# EAGLE design multiwii-conn (EAGLE 6.4)
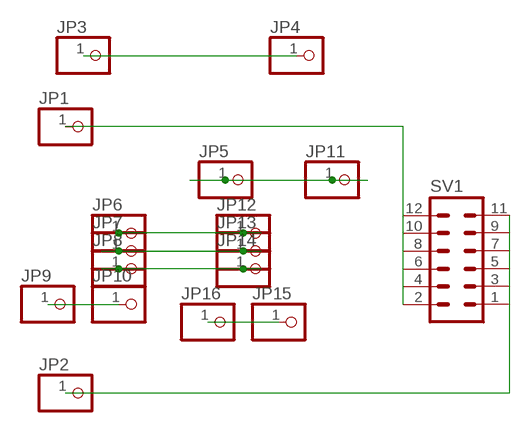
[diagram p0: schematic, sheet 1]

## Parts
JP1  PINHD-1X1  [1X01]
JP2  PINHD-1X1  [1X01]
JP3  PINHD-1X1  [1X01]
JP4  PINHD-1X1  [1X01]
JP5  PINHD-1X1  [1X01]
JP6  PINHD-1X1  [1X01]
JP7  PINHD-1X1  [1X01]
JP8  PINHD-1X1  [1X01]
JP9  PINHD-1X1  [1X01]
JP10  PINHD-1X1  [1X01]
JP11  PINHD-1X1  [1X01]
JP12  PINHD-1X1  [1X01]
JP13  PINHD-1X1  [1X01]
JP14  PINHD-1X1  [1X01]
JP15  PINHD-1X1  [1X01]
JP16  PINHD-1X1  [1X01]
SV1  MA06-2  [MA06-2]

## Nets
N$1: JP5.1 JP11.1
N$2: JP6.1 JP12.1
N$3: JP7.1 JP13.1
N$4: JP8.1 JP14.1
N$5: JP15.1 JP16.1
N$7: JP9.1 JP10.1
N$8: JP3.1 JP4.1
N$11: JP1.1 SV1.2 SV1.4 SV1.6 SV1.8 SV1.10 SV1.12
N$12: JP2.1 SV1.1 SV1.3 SV1.5 SV1.7 SV1.9 SV1.11

## Library data of the parts
JP1-JP16 = pinhead:PINHD-1X1: PIN HEADER
SV1 = con-lstb:MA06-2: PIN HEADER; OC_FARNELL: unknown; OC_NEWARK: unknown

## Board
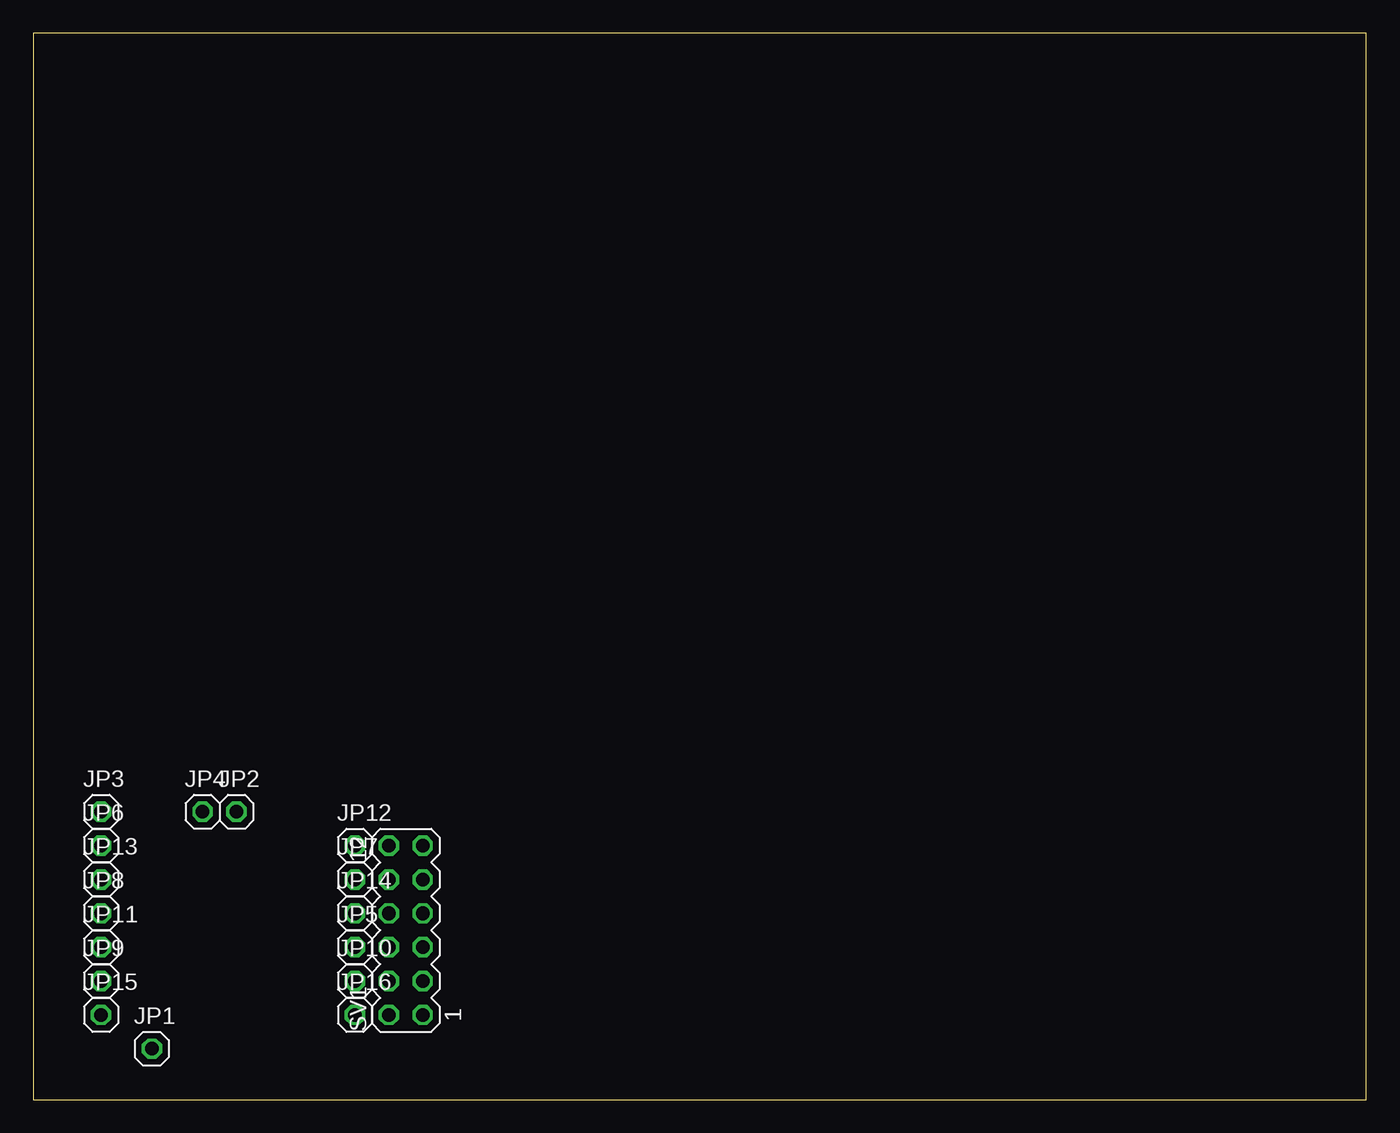
[diagram p1: board, top side]
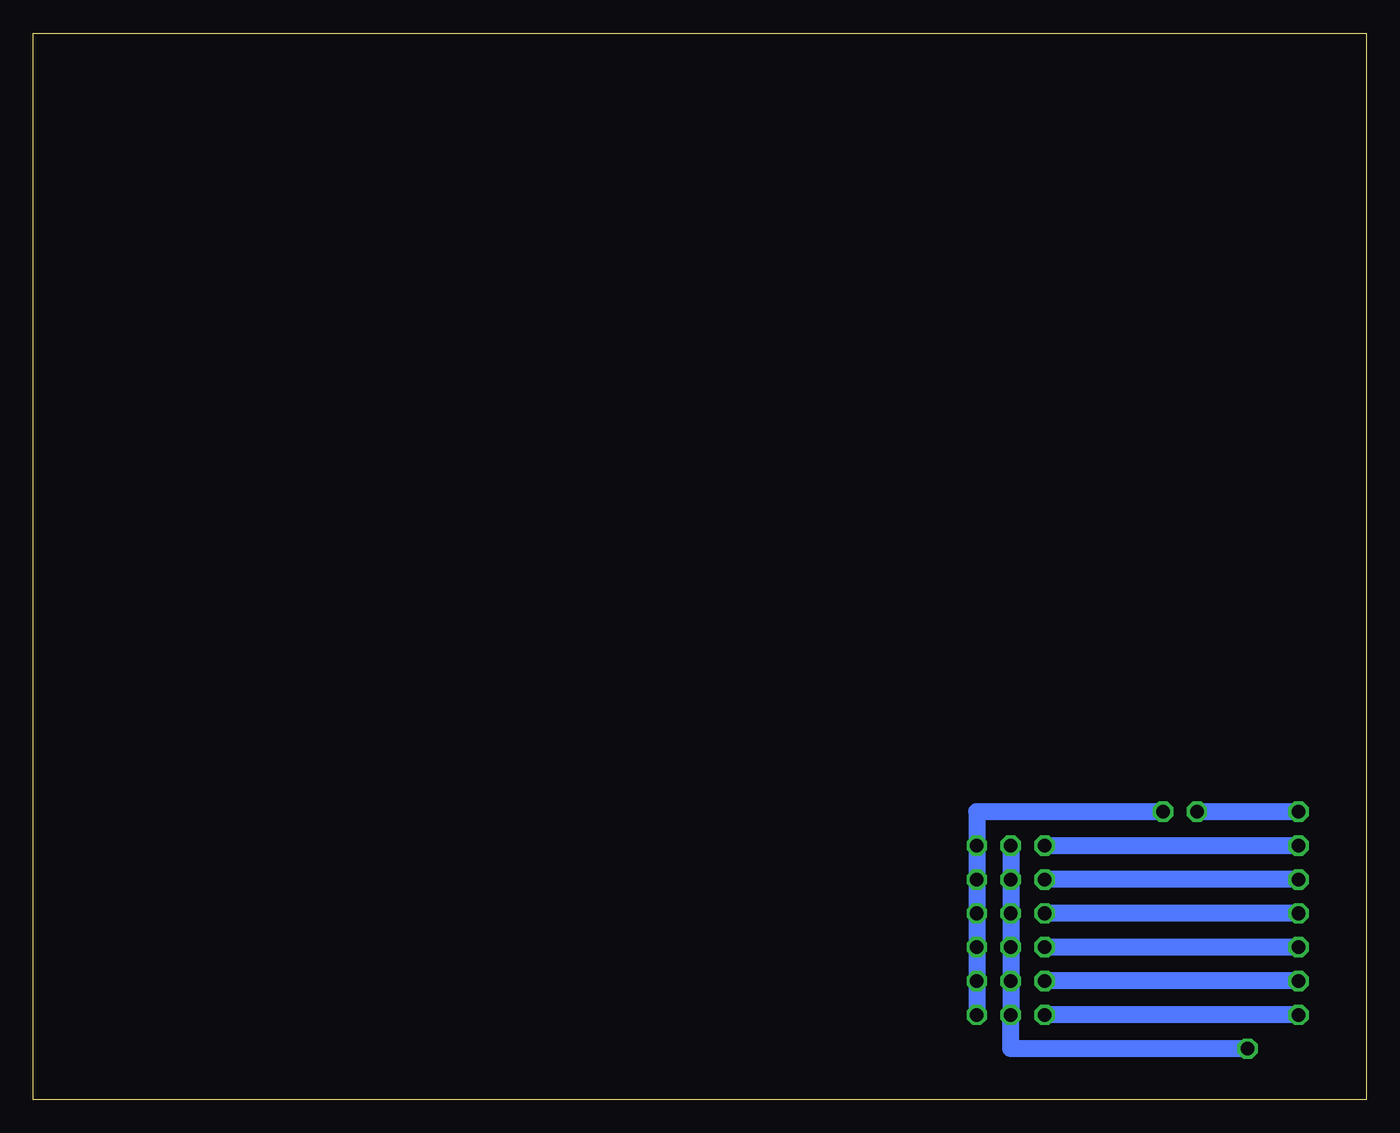
[diagram p2: board, bottom side, seen from below]

Size 100 x 80 mm. Coordinates in mm from the lower left corner, seen from the top.
Outline: 0,0 100,0 100,80 0,80 0,0
Copper layers (1*16): Top 0.035mm / dielectric 1.5mm / Bottom 0.035mm
Design rules "default": minimum track width 10mil, minimum drill 24mil, track to track 8mil, track to pad 8mil, pad to pad 8mil, via to via 8mil, smd to smd 8mil, copper to edge 40mil, drill to drill 8mil, minimum pad ring 10mil, minimum via ring 8mil, stop-mask expansion 4mil, vias tented up to drill 0mil, thermal gap 10mil

### Footprints (pad centres in the part's own frame; a part is rotated, then mirrored left to right if it is on the bottom)
1X01 = drill 1.016 octagon: 1 0,0
MA06-2 = drill 1.016 octagon: 1 -6.35,-1.27; 2 -6.35,1.27; 3 -3.81,-1.27; 4 -3.81,1.27; 5 -1.27,-1.27; 6 -1.27,1.27; 7 1.27,-1.27; 8 1.27,1.27; 9 3.81,-1.27; 10 3.81,1.27; 11 6.35,-1.27; 12 6.35,1.27

### Placement (x,y rotation side)
JP1  8.89,3.81 0 top
JP2  15.24,21.59 0 top
JP3  5.08,21.59 0 top
JP4  12.7,21.59 0 top
JP5  24.13,11.43 0 top
JP6  5.08,19.05 0 top
JP7  24.13,16.51 0 top
JP8  5.08,13.97 0 top
JP9  5.08,8.89 0 top
JP10  24.13,8.89 0 top
JP11  5.08,11.43 0 top
JP12  24.13,19.05 0 top
JP13  5.08,16.51 0 top
JP14  24.13,13.97 0 top
JP15  5.08,6.35 0 top
JP16  24.13,6.35 0 top
SV1  27.94,12.7 90 top

### Tracks (layer width: path | path; a pad name or v marks a point on that pad's centre or on a via)
N$1
  Bottom 1.27: JP11.1 JP5.1
N$2
  Bottom 1.27: JP6.1 JP12.1
N$3
  Bottom 1.27: JP13.1 JP7.1
N$4
  Bottom 1.27: JP8.1 JP14.1
N$5
  Bottom 1.27: JP15.1 JP16.1
N$7
  Bottom 1.27: JP9.1 JP10.1
N$8
  Bottom 1.27: JP3.1 JP4.1
N$11
  Bottom 1.27: SV1.12 SV1.10 SV1.8 SV1.6 SV1.4 SV1.2 26.67,3.81 JP1.1
N$12
  Bottom 1.27: SV1.1 SV1.3 SV1.5 SV1.7 SV1.9 SV1.11 29.21,21.59 JP2.1